# Altium schematic sheet CapacitorBank.SchDoc
size A0; SheetNumber: 2; SheetTotal: 2
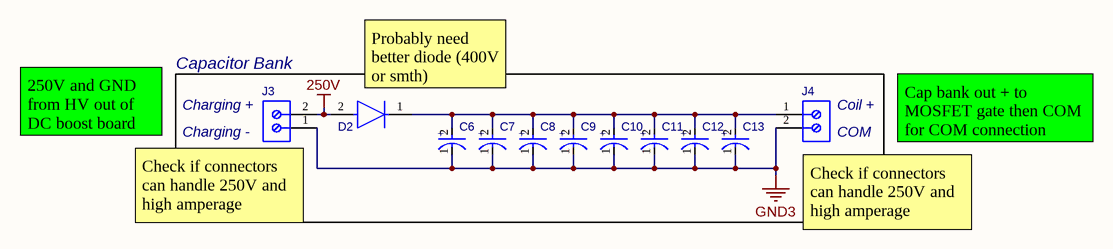
[diagram p0: CapacitorBank.SchDoc]

## Parts
C6  450VXH150MEFCSN25X30  [FP-VXH25X30-MFG]  (value not drawn)
C7  450VXH150MEFCSN25X30  [FP-VXH25X30-MFG]  (value not drawn)
C8  450VXH150MEFCSN25X30  [FP-VXH25X30-MFG]  (value not drawn)
C9  450VXH150MEFCSN25X30  [FP-VXH25X30-MFG]  (value not drawn)
C10  450VXH150MEFCSN25X30  [FP-VXH25X30-MFG]  (value not drawn)
C11  450VXH150MEFCSN25X30  [FP-VXH25X30-MFG]  (value not drawn)
C12  450VXH150MEFCSN25X30  [FP-VXH25X30-MFG]  (value not drawn)
C13  450VXH150MEFCSN25X30  [FP-VXH25X30-MFG]  (value not drawn)
D2  1N4007  [FP-1N4007-MFG]  (value not drawn)
J3  691102710002  [691102710002]  (value not drawn)
J4  691102710002  [691102710002]  (value not drawn)

## Nets
250V: D2.2(A) J3.2
GND3: C6.1(C) C7.1(C) C8.1(C) C9.1(C) C10.1(C) C11.1(C) C12.1(C) C13.1(C) J3.1 J4.2
NetC6_2: C6.2(A) C7.2(A) C8.2(A) C9.2(A) C10.2(A) C11.2(A) C12.2(A) C13.2(A) D2.1(C) J4.1

## Notes on the sheet
- (near J3) Capacitor Bank
- (near D2) Probably need better diode (400V or smth)
- 250V and GND from HV out of DC boost board
- (near J3) Charging +
- (near J3) Charging -
- (near J4) Coil +
- (near J4) COM
- Cap bank out + to MOSFET gate then COM for COM connection
- (near J3) Check if connectors can handle 250V and high amperage
- (near J4) Check if connectors can handle 250V and high amperage
- (in symbol CMP-01474-28338259-1) +

## Library data of the parts
C6-C13 = CMP-01474-28338259-1: 450VXH150MEFCSN25X30 Cap Alum 150UF 20% 450V Snap; Life (Hours): 5000hours; Leakage Current: 779.42µA; Ripple Current: 1.12A; Capacitance: 150µF; Polarity: Polar; Min Operating Temperature: -25°C; Lead Pitch: 10.0076mm; Dissipation Factor: 20%; Voltage Rating: 450V; Tolerance: 20%; Height: 32mm; NexarPartId: 28338259; Max Operating Temperature: 105°C; Mount: Through Hole; Packaging: Bulk; Case/Package: Radial; Height - Seated (Max): 32.004mm; RoHS: Compliant
D2 = CMP-123542-000001-1: Rectifier diode 1000 V 1 A DO-41, ,; Manufacturer: Diotec; Max Surge Forward Current: 27A; Forward Current: 1A; Max Junction Temp: +175°C; Reverse Voltage: 1000V; Value: 15pF; Peak Reverse Current: 5uA; Category: Diode; Temperature Range Low: -50°C; Automotive: No; Temperature: -50°C to +175°C; Lead Free: Yes; ComponentLink2Description: Datasheet; Max Repetitive Reverse Voltage: 1000V; ComponentLink2URL: https://datasheet.octopart.com/1N4007-Diotec-datasheet-62346875.pdf; Manufacturer Part Number: 1N4007; Device Class L3: Rectifier Diodes; Height: 2.8mm; Octopart: https://octopart.com/1n4007-diotec-4040411; Package: 1N4007; Temperature Range High: +175°C; Device Class L1: Discrete Semiconductors; Device Class L2: Diodes; RoHS: TRUE; Capacitance: 15pF; Ipc Land Pattern Name: DIOAD888W100L520D280
J3 J4 = CMP-1502-03258-2: NexarPartId: 8917706; Number of Levels: 1; Number of Positions Per Level: 2; Current: 15A; Voltage: 300V; Pitch: 5.0038mm; Plating: Steel; Stripping Length: -6mm; Wire Gauge (Min): 14AWG; Wire Gauge (Max): 22AWG; Length: 7.5mm; Contact Material: Brass; Contact Plating: Tin; Packaging: Box; Number of Pins: 2; Voltage Rating: 300V; Termination: Screw; Number of Contacts: 2; Color: Blue; Current Rating: 15A; Mount: Through Hole; Max Operating Temperature: 105°C; Min Operating Temperature: -40°C; REACH SVHC: Unknown; Height: 13.4mm; Width: 11.2mm; Housing Material: Nylon; RoHS: Compliant; Wire/Cable Gauge: 22AWG; Lead Pitch: 5mm